# Altium schematic sheet SensorInAmp.SchDoc
size A3
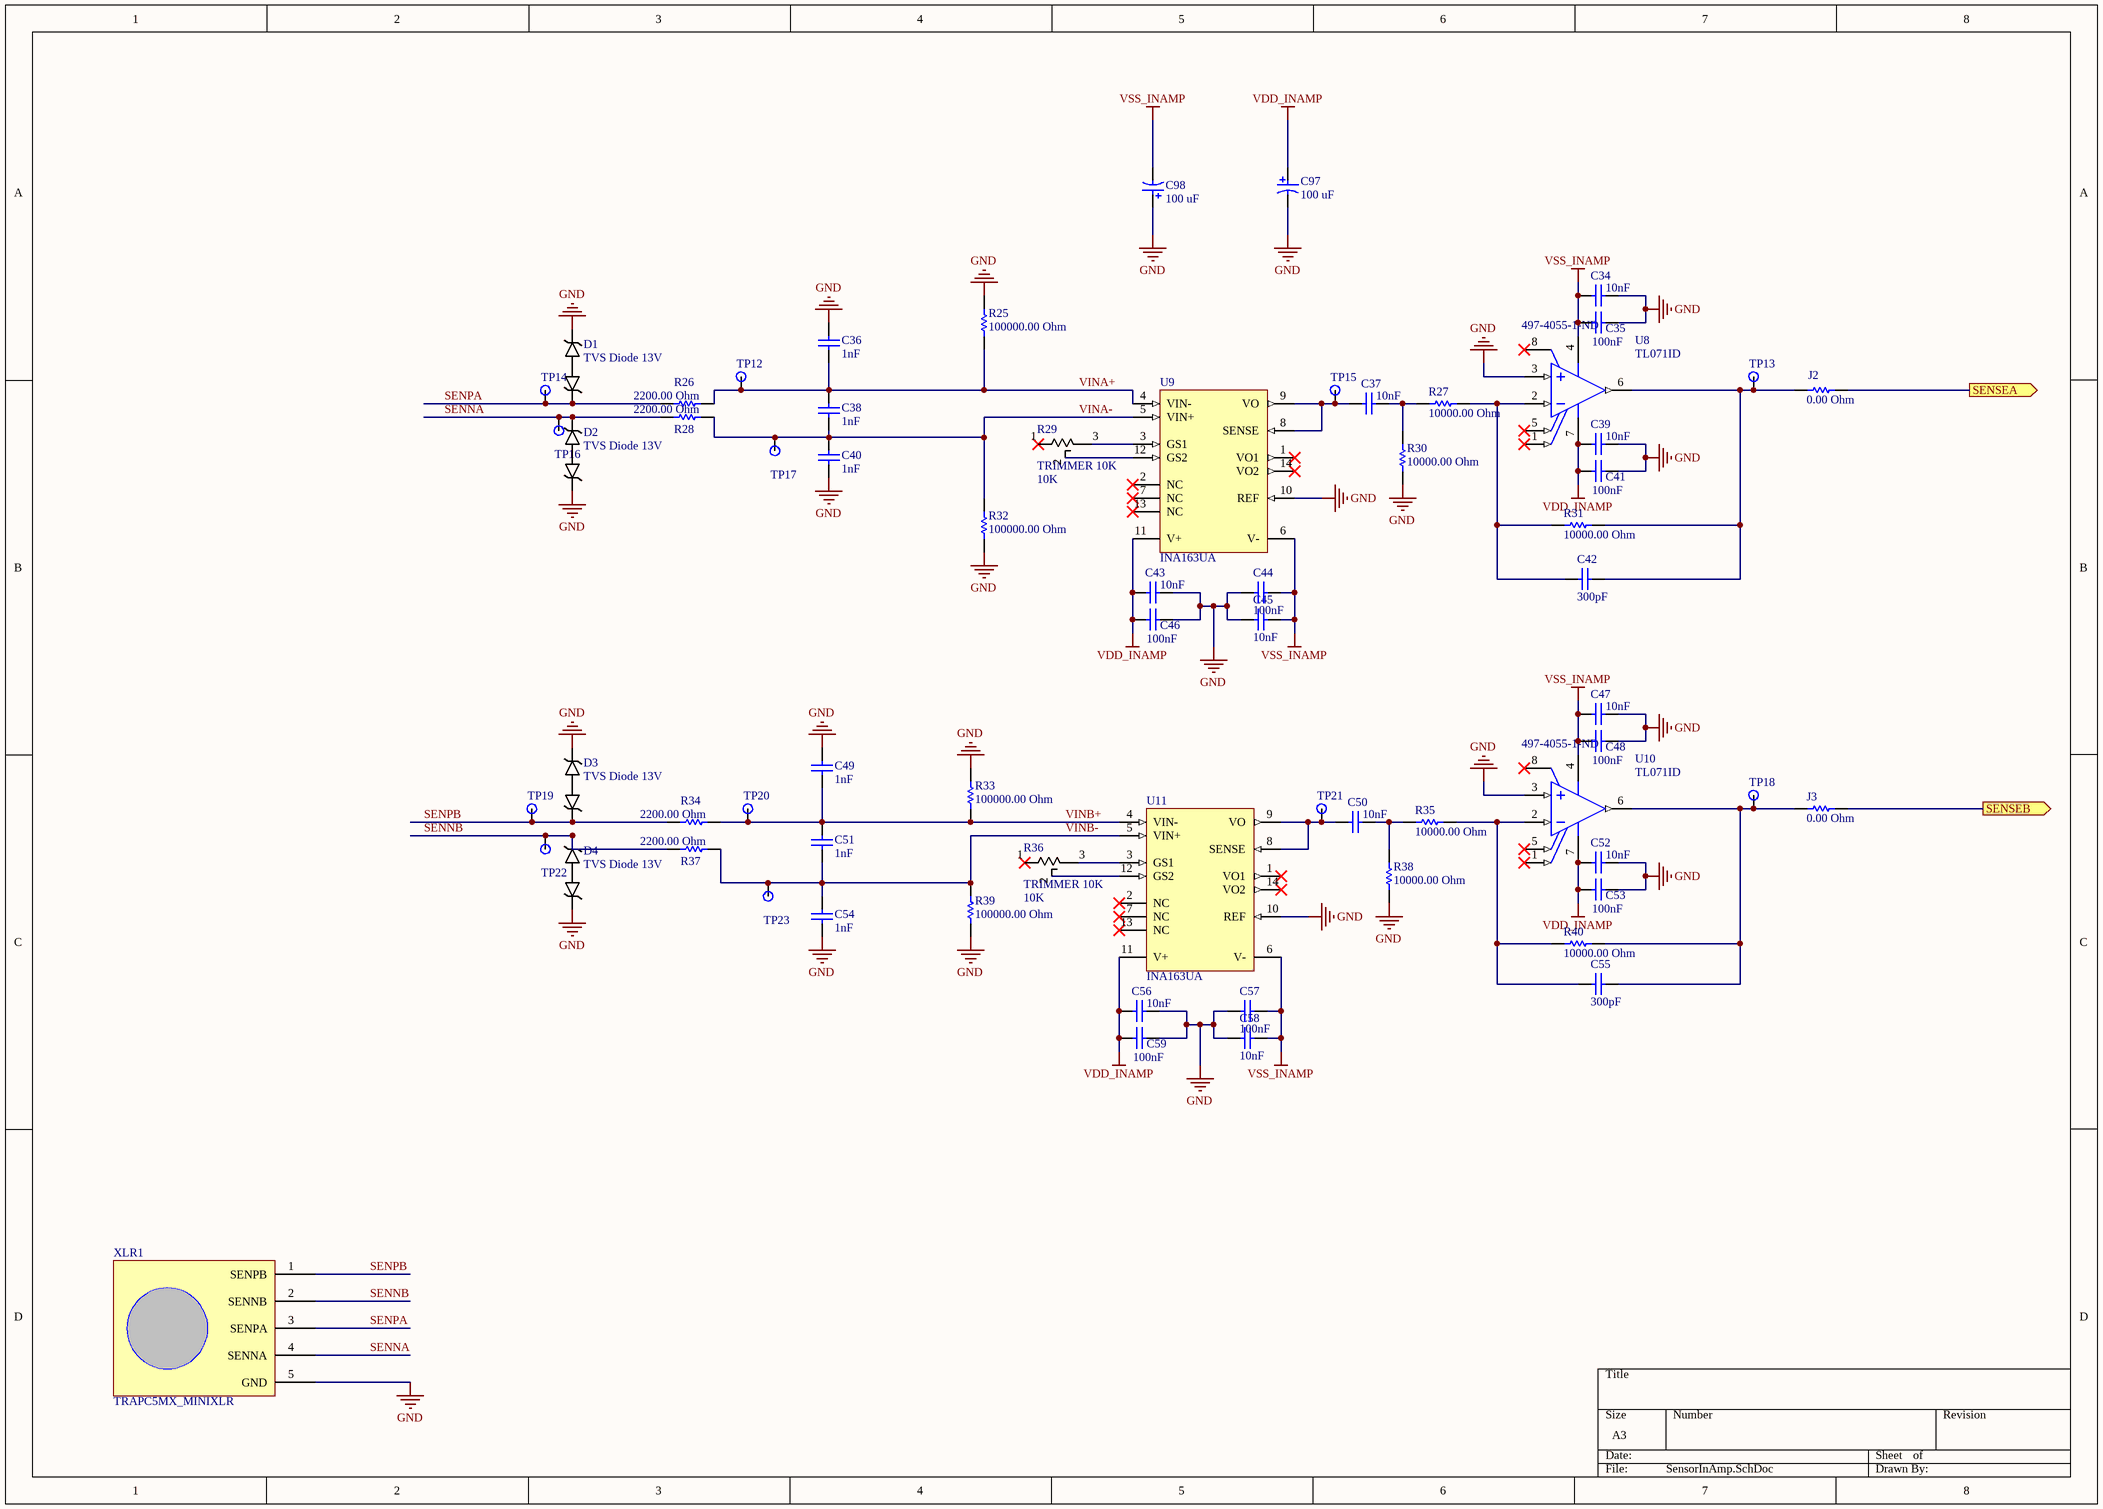
[diagram p0: SensorInAmp.SchDoc]

## Parts
C34  value 10nF  [CAPC0603(1608)100_N]  (hidden comment: CAP 10nF 25V 0603(1608))
C35  value 100nF  [CAPC0603(1608)100_M]  (hidden comment: CAP 100nF 25V 0603(1608))
C36  value 1nF  [CAPC0603(1608)100_M]  (hidden comment: CAP 1nF 25V 0603(1608))
C37  value 10nF  [CAPC0603(1608)100_N]  (hidden comment: CAP 10nF 25V 0603(1608))
C38  value 1nF  [CAPC0603(1608)100_M]  (hidden comment: CAP 1nF 25V 0603(1608))
C39  value 10nF  [CAPC0603(1608)100_N]  (hidden comment: CAP 10nF 25V 0603(1608))
C40  value 1nF  [CAPC0603(1608)100_M]  (hidden comment: CAP 1nF 25V 0603(1608))
C41  value 100nF  [CAPC0603(1608)100_M]  (hidden comment: CAP 100nF 25V 0603(1608))
C42  value 300pF  [CAPC0603(1608)100_N]  (hidden comment: CAP 300pF 25V 0603(1608))
C43  value 10nF  [CAPC0603(1608)100_N]  (hidden comment: CAP 10nF 25V 0603(1608))
C44  value 100nF  [CAPC0603(1608)100_M]  (hidden comment: CAP 100nF 25V 0603(1608))
C45  value 10nF  [CAPC0603(1608)100_N]  (hidden comment: CAP 10nF 25V 0603(1608))
C46  value 100nF  [CAPC0603(1608)100_M]  (hidden comment: CAP 100nF 25V 0603(1608))
C47  value 10nF  [CAPC0603(1608)100_N]  (hidden comment: CAP 10nF 25V 0603(1608))
C48  value 100nF  [CAPC0603(1608)100_M]  (hidden comment: CAP 100nF 25V 0603(1608))
C49  value 1nF  [CAPC0603(1608)100_M]  (hidden comment: CAP 1nF 25V 0603(1608))
C50  value 10nF  [CAPC0603(1608)100_N]  (hidden comment: CAP 10nF 25V 0603(1608))
C51  value 1nF  [CAPC0603(1608)100_M]  (hidden comment: CAP 1nF 25V 0603(1608))
C52  value 10nF  [CAPC0603(1608)100_N]  (hidden comment: CAP 10nF 25V 0603(1608))
C53  value 100nF  [CAPC0603(1608)100_M]  (hidden comment: CAP 100nF 25V 0603(1608))
C54  value 1nF  [CAPC0603(1608)100_M]  (hidden comment: CAP 1nF 25V 0603(1608))
C55  value 300pF  [CAPC0603(1608)100_N]  (hidden comment: CAP 300pF 25V 0603(1608))
C56  value 10nF  [CAPC0603(1608)100_N]  (hidden comment: CAP 10nF 25V 0603(1608))
C57  value 100nF  [CAPC0603(1608)100_M]  (hidden comment: CAP 100nF 25V 0603(1608))
C58  value 10nF  [CAPC0603(1608)100_N]  (hidden comment: CAP 10nF 25V 0603(1608))
C59  value 100nF  [CAPC0603(1608)100_M]  (hidden comment: CAP 100nF 25V 0603(1608))
C97  100 uF  [CAPPR55-250-1120X630X1220]
C98  100 uF  [CAPPR55-250-1120X630X1220]
D1  TVS Diode 13V  [CPDUR5V0R-HF]
D2  TVS Diode 13V  [CPDUR5V0R-HF]
D3  TVS Diode 13V  [CPDUR5V0R-HF]
D4  TVS Diode 13V  [CPDUR5V0R-HF]
J2  0.00 Ohm  [RESC1206(3216)_M]
J3  0.00 Ohm  [RESC1206(3216)_M]
R25  value 100000.00 Ohm  [RESC0603(1608)_N]  (hidden comment: 100K 5% 0603(1608))
R26  value 2200.00 Ohm  [RESC0603(1608)_L]  (hidden comment: 2K2 1% 0603(1608))
R27  value 10000.00 Ohm  [RESC0603(1608)_N]  (hidden comment: 10K 5% 0603(1608))
R28  value 2200.00 Ohm  [RESC0603(1608)_L]  (hidden comment: 2K2 1% 0603(1608))
R29  TRIMMER 10K  value 10K  [TRIMMER 10K]
R30  value 10000.00 Ohm  [RESC0603(1608)_N]  (hidden comment: 10K 5% 0603(1608))
R31  value 10000.00 Ohm  [RESC0603(1608)_N]  (hidden comment: 10K 5% 0603(1608))
R32  value 100000.00 Ohm  [RESC0603(1608)_N]  (hidden comment: 100K 5% 0603(1608))
R33  value 100000.00 Ohm  [RESC0603(1608)_N]  (hidden comment: 100K 5% 0603(1608))
R34  value 2200.00 Ohm  [RESC0603(1608)_L]  (hidden comment: 2K2 1% 0603(1608))
R35  value 10000.00 Ohm  [RESC0603(1608)_N]  (hidden comment: 10K 5% 0603(1608))
R36  TRIMMER 10K  value 10K  [TRIMMER 10K]
R37  value 2200.00 Ohm  [RESC0603(1608)_L]  (hidden comment: 2K2 1% 0603(1608))
R38  value 10000.00 Ohm  [RESC0603(1608)_N]  (hidden comment: 10K 5% 0603(1608))
R39  value 100000.00 Ohm  [RESC0603(1608)_N]  (hidden comment: 100K 5% 0603(1608))
R40  value 10000.00 Ohm  [RESC0603(1608)_N]  (hidden comment: 10K 5% 0603(1608))
TP12  Testpoint  [0603 PROBE PAD]  (value not drawn)
TP13  Testpoint  [0603 PROBE PAD]  (value not drawn)
TP14  Testpoint  [0603 PROBE PAD]  (value not drawn)
TP15  Testpoint  [0603 PROBE PAD]  (value not drawn)
TP16  Testpoint  [0603 PROBE PAD]  (value not drawn)
TP17  Testpoint  [0603 PROBE PAD]  (value not drawn)
TP18  Testpoint  [0603 PROBE PAD]  (value not drawn)
TP19  Testpoint  [0603 PROBE PAD]  (value not drawn)
TP20  Testpoint  [0603 PROBE PAD]  (value not drawn)
TP21  Testpoint  [0603 PROBE PAD]  (value not drawn)
TP22  Testpoint  [0603 PROBE PAD]  (value not drawn)
TP23  Testpoint  [0603 PROBE PAD]  (value not drawn)
U8  TL071ID  Supplier Part Number 1: 497-4055-1-ND  [D0008A_L]
U9  INA163UA  [D0014A_L]
U10  TL071ID  Supplier Part Number 1: 497-4055-1-ND  [D0008A_L]
U11  INA163UA  [D0014A_L]
XLR1  TRAPC5MX_MINIXLR  [MiniXLR_TRAPC5MX_5POS]

## Ports
SENSEA (out), SENSEB (out)

## Nets
GND: C34.2 C35.1 C36.2 C39.2 C40.1 C41.1 C43.2 C44.1 C45.2 C46.1 C47.2 C48.1 C49.2 C52.2 C53.1 C54.1 C56.2 C57.1 C58.2 C59.1 C97.2 C98.1 D1.2 D2.1 D3.2 D4.1 R25.1 R30.2 R32.2 R33.1 R38.2 R39.2 U8.3(IN+) U9.10(REF) U10.3(IN+) U11.10(REF) XLR1.5(GND)
VDD_INAMP: C39.1 C41.2 C43.1 C46.2 C52.1 C53.2 C56.1 C59.2 C97.1 U8.7(VCC+) U9.11(V+) U10.7(VCC+) U11.11(V+)
VSS_INAMP: C34.1 C35.2 C44.2 C45.1 C47.1 C48.2 C57.2 C58.1 C98.2 U8.4(VCC-) U9.6(V-) U10.4(VCC-) U11.6(V-)
SENNA: D2.2 R28.2 TP16.0 XLR1.4(SENNA)
SENNB: D4.2 R37.2 TP22.0 XLR1.2(SENNB)
SENPA: D1.1 R26.2 TP14.0 XLR1.3(SENPA)
SENPB: D3.1 R34.2 TP19.0 XLR1.1(SENPB)
SENSEA: J2.2 ; port SENSEA
SENSEB: J3.2 ; port SENSEB
VINA+: C36.1 C38.2 R25.2 R26.1 TP12.0 U9.4(VIN-)
VINA-: C38.1 C40.2 R28.1 R32.1 TP17.0 U9.5(VIN+)
VINB+: C49.1 C51.2 R33.2 R34.1 TP20.0 U11.4(VIN-)
VINB-: C51.1 C54.2 R37.1 R39.1 TP23.0 U11.5(VIN+)
NetC37_1: C37.1 TP15.0 U9.8(SENSE) U9.9(VO)
NetC37_2: C37.2 R27.2 R30.1
NetC42_1: C42.1 J2.1 R31.1 TP13.0 U8.6(OUT)
NetC42_2: C42.2 R27.1 R31.2 U8.2(IN-)
NetC50_1: C50.1 TP21.0 U11.8(SENSE) U11.9(VO)
NetC50_2: C50.2 R35.2 R38.1
NetC55_1: C55.1 J3.1 R40.1 TP18.0 U10.6(OUT)
NetC55_2: C55.2 R35.1 R40.2 U10.2(IN-)
NetR29_2: R29.2 U9.12(GS2)
NetR29_3: R29.3 U9.3(GS1)
NetR36_2: R36.2 U11.12(GS2)
NetR36_3: R36.3 U11.3(GS1)

Not connected (* = marked no-connect by the designer): R29 1*; R36 1*; U8 1(OFFSET_N1)* 5(OFFSET_N2)* 8(NC)*; U9 1(VO1)* 2(NC)* 7(NC)* 13(NC)* 14(VO2)*; U10 1(OFFSET_N1)* 5(OFFSET_N2)* 8(NC)*; U11 1(VO1)* 2(NC)* 7(NC)* 13(NC)* 14(VO2)*

## Library data of the parts
C34 C37 C39 C43 C45 C47 C50 C52 C56 C58 = CMP-1035-02317-1: CAP 10nF 25V ±10% 0603 (1608 Metric) Thickness 1mm SMD; Tolerance: Â±10%; Case-Metric: 1608; Case-EIA: 0603; Max Thickness: 1 mm; Rated Voltage: 25 V; Technology: SMT; OrderURL: http://www.digikey.ie/product-detail/en/yageo/CC0603KRX7R8BB103/311-1360-1-ND/2103144; Supplier 1: Digi-Key; Supplier Part Number: 311-1360-1-ND; Supplier Part Number 1: 311-1360-1-ND
C35 C41 C44 C46 C48 C53 C57 C59 = CMP-1035-02588-1: CAP 100nF 25V ±10% 0603 (1608 Metric) Thickness 1mm SMD; Case-Metric: 1608; Case-EIA: 0603; Tolerance: Â±10%; Max Thickness: 1 mm; Technology: SMT; Rated Voltage: 25 V; OrderURL: http://www.digikey.ie/product-detail/en/yageo/CC0603KRX7R8BB104/311-1341-1-ND/2103125; Supplier 1: Digi-Key; Supplier Part Number 1: 311-1341-1-ND
C36 C38 C40 C49 C51 C54 = CMP-1035-01883-1: CAP 1nF 25V ±5% 0603 (1608 Metric) Thickness 1mm SMD; Case-EIA: 0603; Tolerance: Â±5%; Case-Metric: 1608; Technology: SMT; Rated Voltage: 25 V; Max Thickness: 1 mm
C42 C55 = CMP-1035-01546-1: CAP 300pF 25V ±10% 0603 (1608 Metric) Thickness 1mm SMD; Tolerance: Â±10%; Case-EIA: 0603; Case-Metric: 1608; Rated Voltage: 25 V; Technology: SMT; Max Thickness: 1 mm
C97 C98 = CMP-1665-00015-4: Aluminum Electrolytic Capacitor (Radial Lead Type), 100 uF, 35 V, -40 to 85 degC, 2-Pin THD, RoHS, Bulk; Manufacturer: Panasonic; Voltage Rating: 35 V; PackageReference: Radial; ComponentLink2URL: http://industrial.panasonic.com/cdbs/www-data/pdf/RDF0000/ABA0000C1047.pdf; DatasheetVersion: 03/2016; REACH SVHC: No SVHC; Mounting Technology: Through Hole; ComponentLink2Description: Datasheet; Packaging: Bulk; Lead Pitch: 2.5 mm; Height: 11.2 mm; Pins: 2; RoHSCompliant: true; Mount: Through Hole; Package Quantity: 200; Min Operating Temperature: -40 degC; Max Operating Temperature: 85 degC; PackageDescription: 2-Pin Through Hole Device, Dia 6.3 mm, Body Length 11.2 mm; ComponentLink1Description: Manufacturer URL; Length: 11.2 mm; ComponentLink1URL: http://www.panasonic.com/
D1-D4 = CPDUR5V0R-HF: TVS DIODE 5VWM 13VC SOD-523F; Manufacturer: Comchip Technology; Type: Zener; Voltage - Reverse Standoff (Typ): 5V (Max); Voltage - Breakdown (Min): 5.6V; Current - Peak Pulse (10/1000µs): 12A (8/20µs); Power Line Protection: No; Capacitance @ Frequency: 20pF @ 1MHz; Value: 1K; Published: 8-Jun-2000; LatestRevisionDate: 29-May-2009; LatestRevisionNote: IPC-7351 Footprint Added.; PackageReference: J1-0603; Publisher: Altium Limited; PackageDescription: Chip Resistor; Manufacturer Part Number: CPDUR5V0R-HF; RoHS: RoHS Compliant; Category: Circuit Protection; Packaging: Cut Tape (CT); Part Status: Active; Voltage - Clamping (Max) @ Ipp: 13V; Power - Peak Pulse: -; Applications: General Purpose; Operating Temperature: -40°C ~ 150°C (TJ); Mounting Type: Surface Mount; Package / Case: SC-79, SOD-523; Supplier Device Package: 0603/SOD-523F; ComponentLink1URL: http://www.comchiptech.com/cms/UserFiles/CPDUR5V0R-HF-Rev%20B339379.pdf; ComponentLink1Description: http://www.comchiptech.com/cms/UserFiles/CPDUR5V0R-HF-Rev%20B339379.pdf; Supplier 1: Digi-Key; Supplier Part Number 1: 641-1526-1-ND; Stock 1: 6593; Pricing 1: 1=0.38, 10=0.271, 25=0.2112, 100=0.1597, 250=0.113, 500=0.09044, 1000=0.06933 (EUR)
J2 J3 = CMP-1014-00001-1: Jumper 1206 (3216 Metric); Tolerance: None; Case-EIA: 1206; Case-Metric: 3216; Technology: SMT; Power: None; Value: 0.00 Ohm; OrderURL: http://www.digikey.ie/product-detail/en/yageo/RC0603JR-070RL/311-0.0GRCT-ND/729622; Supplier 1: Digi-Key; Supplier Part Number 1: 311-0.0GRCT-ND
R25 R32 R33 R39 = CMP-1012-00122-1: 100K 0.1W 5% 0603 (1608 Metric)  SMD; Case-EIA: 0603; Case-Metric: 1608; Tolerance: 5 %; Power: 0.1 W; Technology: SMT; OrderURL: http://www.digikey.ie/product-detail/en/yageo/RC0603JR-07100KL/311-100KGRCT-ND/729645; Supplier Part Number 1: 311-100KGRCT-ND; Supplier 1: Digi-Key
R26 R28 R34 R37 = CMP-1012-00546-1: 2K2 0.1W 1% 0603 (1608 Metric)  SMD; Case-EIA: 0603; Case-Metric: 1608; Tolerance: 1 %; Power: 0.1 W; Technology: SMT
R27 R30 R31 R35 R38 R40 = CMP-1012-00098-1: 10K 0.1W 5% 0603 (1608 Metric)  SMD; Case-EIA: 0603; Case-Metric: 1608; Technology: SMT; Tolerance: 5 %; Power: 0.1 W; OrderURL: http://www.digikey.ie/product-detail/en/yageo/RC0603JR-0710KL/311-10KGRCT-ND/729647; Supplier 1: Digi-Key; Supplier Part Number 1: 311-10KGRCT-ND
R29 R36 = TRIMMER 10K: TRIMMER 10K OHM 0.5W TH; Manufacturer: TE Connectivity Passive Product; Manufacturer Part Number: 1-1623849-0; Power (Watts): 0.5W, 1/2W; Tolerance: ±10%; Temperature Coefficient: ±100ppm/°C; Number of Turns: 25; Adjustment Type: Top Adjustment; Resistive Material: Cermet; Published: 8-Jun-2000; LatestRevisionDate: 29-May-2009; LatestRevisionNote: IPC-7351 Footprint Added.; PackageReference: J1-0603; Publisher: Altium Limited; PackageDescription: Chip Resistor; RoHS: RoHS Compliant; Category: Potentiometers, Variable Resistors; Packaging: Bulk; Part Status: Active; Resistance (Ohms): 10k; Mounting Type: Through Hole; Termination Style: PC Pins; Size / Dimension: Rectangular - 0.374" x 0.185" Face x 0.394" H (9.50mm x 4.70mm x 10.00mm); ComponentLink1URL: http://www.te.com/commerce/DocumentDelivery/DDEController?Action=srchrtrv&DocNm=1623849&DocType=Customer+Drawing&DocLang=English; ComponentLink1Description: http://www.te.com/commerce/DocumentDelivery/DDEController?Action=srchrtrv&DocNm=1623849&DocType=Customer+Drawing&DocLang=English; Supplier 1: Digi-Key; Supplier Part Number 1: A105870-ND; Stock 1: 5809; Pricing 1: 1=0.89, 10=0.786, 25=0.7076, 50=0.6816, 100=0.6554, 250=0.61608, 500=0.5243, 1000=0.48499, 5000=0.39848 (EUR)
TP12-TP23 = Testpoint: 0.063" x 0.031" x 0.045" (1.60mm x 0.80mm x 1.15mm); OrderURL: http://www.digikey.ie/product-detail/en/te-connectivity-amp-connectors/RCU-0C/A106145CT-ND/3477802; Value: *; Width: 0.8; Height: 1.15mm; Length: 1.60mm; Supplier Part Number 1: A106145CT-ND; Supplier 1: Digi-Key
U8 U10 = CMP-0017-00492-2: Low-Noise JFET-Input General-Purpose Operational Amplifier, 7 to 36 V, -40 to 85 degC, 8-pin SOIC (D8), Green (RoHS & no Sb/Br); Manufacturer: Texas Instruments; Manufacturer Part Number: TL071CDT; Total Supply Voltage(Max)(+5V is 5, +/-5V is 10): 36; Rating: Military; GBW(Typ)(MHz): 3; CMRR(Min)(dB): 75; Number of Channels: 1; Vn at 1kHz(Typ)(nV/rtHz): 18; Total Supply Voltage(Min)(+5V is 5, +/-5V is 10): 7; IIB(Max)(pA): 200; Slew Rate(Typ)(V/us): 13; Iq per channel(Max)(mA): 2.5; Vio (25C)(Max)(mV): 6; Sub Family: General Purpose Amplifier, High Supply Voltage Amplifier (>=30V); Amplifier Type: J-FET; Slew Rate: 16 V/µs; Gain Bandwidth Product: 4MHz; Current - Input Bias: 20pA; Voltage - Input Offset: 3mV; Current - Supply: 1.4mA; Current - Output / Channel: 40mA; Voltage - Supply, Single/Dual (±): 6 V ~ 36 V, ±3 V ~ 18 V; PackageVersion: 4040047-3/M, 06/2011; ComponentLink2Description: Datasheet; PackageDescription: 8-Pin Plastic Small Outline, Body 4.9 x 3.9 mm, Pitch 1.27 mm; Mounting Technology: Surface Mount; Eco-Plan: Green (RoHS & no Sb/Br); DatasheetVersion: SLOS080J; PackageReference: D0008A; ComponentLink3Description: Package Specification; PartNumber: TL071ID; ComponentLink2URL: http://www.ti.com/lit/ds/symlink/tl071.pdf; ComponentLink3URL: http://www.ti.com/litv/pdf/msoi002j; Offset Drift(Typ)(uV/C): 18; ComponentLink1Description: Manufacturer URL; ComponentLink1URL: http://www.ti.com/; Code_JEDEC: MS-012; OrderURL: http://www.digikey.ie/product-detail/en/stmicroelectronics/TL071CDT/497-4055-1-ND/720975; Supplier 1: Digi-Key; RoHS: RoHS Compliant; Category: Integrated Circuits (ICs); Stock 1: 10528; Pricing 1: 1=0.38, 10=0.328, 100=0.245, 500=0.1925, 1000=0.14876 (EUR); Packaging: Cut Tape (CT); Part Status: Active; Number of Circuits: 1; Output Type: -; -3db Bandwidth: -; Operating Temperature: 0°C ~ 70°C; Mounting Type: Surface Mount; Package / Case: 8-SOIC (0.154", 3.90mm Width); Supplier Device Package: 8-SO; ComponentLink4URL: http://www.st.com/content/ccc/resource/technical/document/datasheet/1b/33/43/ff/18/5f/40/30/CD00000488.pdf/files/CD00000488.pdf/jcr:content/translations/en.CD00000488.pdf; ComponentLink4Description: http://www.st.com/content/ccc/resource/technical/document/datasheet/1b/33/43/ff/18/5f/40/30/CD00000488.pdf/files/CD00000488.pdf/jcr:content/translations/en.CD00000488.pdf
U9 U11 = CMP-0944-00013-2: Low-Noise Low-Distortion Instrumentation Amplifier, -40 to 125 degC, 14-pin SOIC (D14), Green (RoHS & no Sb/Br); Manufacturer: Texas Instruments; Input Offset (+/-)(Max)(uV): 250; Gain(V/V): 1 to 10000; Quiescent Current (+/-)(Typ)(mA): 10; Input Bias Current (+/-)(Max)(nA): 12000; SubFamily: Single Supply; Noise at 1kHz(Typ)(nV/rt(Hz)): 1; Vs(Min)(V): 9; CMRR(Min)(dB): 100; Vs(Max)(V): 36; Non-Linearity (+/-)(Max)(%): 0.0006; ComponentLink3URL: http://www.ti.com/lit/ml/mpds177g/mpds177g.pdf; ComponentLink1Description: Manufacturer URL; Code_JEDEC: MS-012; PackageReference: D0014A; Eco-Plan: Green (RoHS & no Sb/Br); ComponentLink2URL: http://www.ti.com/general/docs/lit/getliterature.tsp?genericPartNumber=INA163&fileType=pdf; PackageVersion: 4040047-5/M, 06/2011; PackageDescription: 14-Pin Plastic Small Outline, Body 8.65 x 3.9 mm, Pitch 1.27 mm; PartNumber: INA163UA; DatasheetVersion: SBOS177D; ComponentLink2Description: Datasheet; ComponentLink3Description: Package Specification; ComponentLink1URL: http://www.ti.com/; Mounting Technology: Surface Mount
XLR1 = TRAPC5MX_MINIXLR: CONN RCPT 5POS R/A MALE T/H; Manufacturer: Switchcraft Inc.; Connector Type: Receptacle, Male Pins; Number of Positions: 5; Current Rating: 5A; Voltage - Rated: 125VAC; Published: 8-Jun-2000; LatestRevisionDate: 29-May-2009; LatestRevisionNote: IPC-7351 Footprint Added.; PackageReference: J1-0603; Publisher: Altium Limited; PackageDescription: Chip Resistor; Manufacturer Part Number: TRAPC5MX; RoHS: RoHS Compliant; Category: Connectors, Interconnects; Packaging: Bulk; Part Status: Active; Shell Size - Insert: Mini XLR; Shell Size, MIL: -; Mounting Type: Through Hole, Right Angle; Termination: Solder; Fastening Type: Threaded; Orientation: Keyed; Ingress Protection: -; Shell Material, Finish: Thermoplastic; Contact Finish: Tin; Features: Board Guide; Contact Finish Thickness: -; Operating Temperature: -55°C ~ 85°C; ComponentLink1URL: http://www.switchcraft.com/Drawings/TRAPC_X-TRASM_X_SERIES_CD.PDF; ComponentLink1Description: http://www.switchcraft.com/Drawings/TRAPC_X-TRASM_X_SERIES_CD.PDF; Supplier 1: Digi-Key; Supplier Part Number 1: SC2056-ND; Stock 1: 291; Pricing 1: 1=6.25, 10=5.041, 25=4.602, 50=4.3826, 100=4.1636, 250=3.80444 (EUR)